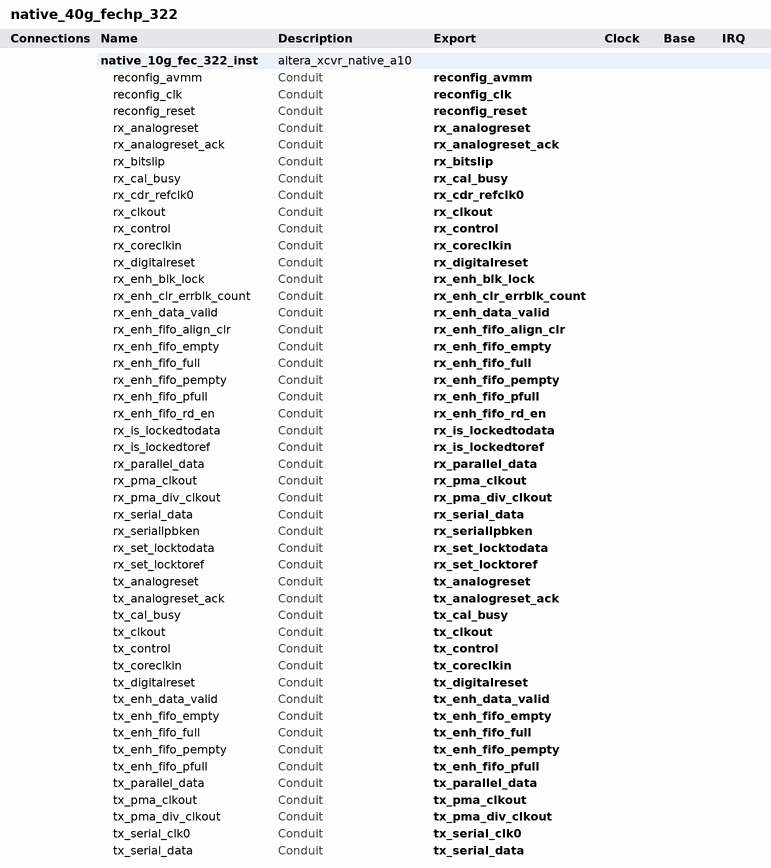
[diagram p0: system contents]
# Platform Designer (Qsys) system native_40g_fechp_322, Arria 10 10AX115U3F45I2SG
# Parameters at their usual value, and those the tool derives, are not listed.
package require -exact qsys 15.1
create_system native_40g_fechp_322
set_project_property DEVICE_FAMILY {Arria 10}
set_project_property DEVICE 10AX115U3F45I2SG

add_instance native_10g_fec_322_inst altera_xcvr_native_a10 15.1
set_instance_property native_10g_fec_322_inst AUTO_EXPORT true
set_instance_parameter_value native_10g_fec_322_inst anlg_rx_adp_ctle_acgain_4s radp_ctle_acgain_4s_0
set_instance_parameter_value native_10g_fec_322_inst anlg_rx_adp_ctle_eqz_1s_sel radp_ctle_eqz_1s_sel_0
set_instance_parameter_value native_10g_fec_322_inst anlg_rx_adp_vga_sel radp_vga_sel_0
set_instance_parameter_value native_10g_fec_322_inst anlg_rx_eq_dc_gain_trim no_dc_gain
set_instance_parameter_value native_10g_fec_322_inst anlg_rx_one_stage_enable non_s1_mode
set_instance_parameter_value native_10g_fec_322_inst anlg_voltage 1_1V
set_instance_parameter_value native_10g_fec_322_inst base_device NIGHTFURY5
set_instance_parameter_value native_10g_fec_322_inst bonded_mode not_bonded
set_instance_parameter_value native_10g_fec_322_inst channels 4
set_instance_parameter_value native_10g_fec_322_inst disconnect_analog_resets 0
set_instance_parameter_value native_10g_fec_322_inst enable_port_rx_analog_reset_ack 1
set_instance_parameter_value native_10g_fec_322_inst enable_port_rx_enh_bitslip 1
set_instance_parameter_value native_10g_fec_322_inst enable_port_rx_enh_blk_lock 1
set_instance_parameter_value native_10g_fec_322_inst enable_port_rx_enh_clr_errblk_count 1
set_instance_parameter_value native_10g_fec_322_inst enable_port_rx_enh_data_valid 1
set_instance_parameter_value native_10g_fec_322_inst enable_port_rx_enh_fifo_align_clr 1
set_instance_parameter_value native_10g_fec_322_inst enable_port_rx_enh_fifo_empty 1
set_instance_parameter_value native_10g_fec_322_inst enable_port_rx_enh_fifo_full 1
set_instance_parameter_value native_10g_fec_322_inst enable_port_rx_enh_fifo_pempty 1
set_instance_parameter_value native_10g_fec_322_inst enable_port_rx_enh_fifo_pfull 1
set_instance_parameter_value native_10g_fec_322_inst enable_port_rx_enh_fifo_rd_en 1
set_instance_parameter_value native_10g_fec_322_inst enable_port_rx_pma_clkout 1
set_instance_parameter_value native_10g_fec_322_inst enable_port_rx_pma_div_clkout 1
set_instance_parameter_value native_10g_fec_322_inst enable_port_rx_polinv 0
set_instance_parameter_value native_10g_fec_322_inst enable_port_rx_seriallpbken_tx 0
set_instance_parameter_value native_10g_fec_322_inst enable_port_rx_std_bitslip 0
set_instance_parameter_value native_10g_fec_322_inst enable_port_tx_analog_reset_ack 1
set_instance_parameter_value native_10g_fec_322_inst enable_port_tx_enh_fifo_empty 1
set_instance_parameter_value native_10g_fec_322_inst enable_port_tx_enh_fifo_full 1
set_instance_parameter_value native_10g_fec_322_inst enable_port_tx_enh_fifo_pempty 1
set_instance_parameter_value native_10g_fec_322_inst enable_port_tx_enh_fifo_pfull 1
set_instance_parameter_value native_10g_fec_322_inst enable_port_tx_pma_clkout 1
set_instance_parameter_value native_10g_fec_322_inst enable_port_tx_pma_div_clkout 1
set_instance_parameter_value native_10g_fec_322_inst enable_port_tx_polinv 0
set_instance_parameter_value native_10g_fec_322_inst enable_ports_rx_manual_cdr_mode 1
set_instance_parameter_value native_10g_fec_322_inst enable_simple_interface 0
set_instance_parameter_value native_10g_fec_322_inst enh_pcs_pma_width 64
set_instance_parameter_value native_10g_fec_322_inst enh_pld_pcs_width 66
set_instance_parameter_value native_10g_fec_322_inst enh_rx_blksync_enable 0
set_instance_parameter_value native_10g_fec_322_inst enh_rx_descram_enable 0
set_instance_parameter_value native_10g_fec_322_inst enh_rx_krfec_err_mark_enable 1
set_instance_parameter_value native_10g_fec_322_inst enh_rx_krfec_err_mark_type 40G
set_instance_parameter_value native_10g_fec_322_inst enh_rxfifo_mode Basic
set_instance_parameter_value native_10g_fec_322_inst enh_rxfifo_pempty 7
set_instance_parameter_value native_10g_fec_322_inst enh_tx_scram_enable 0
set_instance_parameter_value native_10g_fec_322_inst enh_tx_scram_seed 288230376151711743
set_instance_parameter_value native_10g_fec_322_inst enh_txfifo_mode Basic
set_instance_parameter_value native_10g_fec_322_inst enh_txfifo_pempty 5
set_instance_parameter_value native_10g_fec_322_inst enh_txfifo_pfull 13
set_instance_parameter_value native_10g_fec_322_inst generate_add_hdl_instance_example 1
set_instance_parameter_value native_10g_fec_322_inst generate_docs 1
set_instance_parameter_value native_10g_fec_322_inst message_level warning
set_instance_parameter_value native_10g_fec_322_inst protocol_mode fortyg_basekr_krfec_mode
set_instance_parameter_value native_10g_fec_322_inst rapid_validate 0
set_instance_parameter_value native_10g_fec_322_inst rcfg_file_prefix altera_xcvr_native_vi
set_instance_parameter_value native_10g_fec_322_inst rcfg_h_file_enable 1
set_instance_parameter_value native_10g_fec_322_inst rcfg_iface_enable 1
set_instance_parameter_value native_10g_fec_322_inst rcfg_jtag_enable 1
set_instance_parameter_value native_10g_fec_322_inst rcfg_mif_file_enable 1
set_instance_parameter_value native_10g_fec_322_inst rcfg_multi_enable 1
set_instance_parameter_value native_10g_fec_322_inst rcfg_profile_cnt 5
set_instance_parameter_value native_10g_fec_322_inst rcfg_profile_select 0
set_instance_parameter_value native_10g_fec_322_inst rcfg_reduced_files_enable 1
set_instance_parameter_value native_10g_fec_322_inst rcfg_separate_avmm_busy 0
set_instance_parameter_value native_10g_fec_322_inst rcfg_shared 1
set_instance_parameter_value native_10g_fec_322_inst rcfg_sv_file_enable 1
set_instance_parameter_value native_10g_fec_322_inst rx_pma_ctle_adaptation_mode one-time
set_instance_parameter_value native_10g_fec_322_inst rx_pma_dfe_adaptation_mode continuous
set_instance_parameter_value native_10g_fec_322_inst rx_pma_dfe_fixed_taps 7
set_instance_parameter_value native_10g_fec_322_inst rx_pma_div_clkout_divider 33
set_instance_parameter_value native_10g_fec_322_inst set_capability_reg_enable 1
set_instance_parameter_value native_10g_fec_322_inst set_cdr_refclk_freq 322.265625
set_instance_parameter_value native_10g_fec_322_inst set_csr_soft_logic_enable 1
set_instance_parameter_value native_10g_fec_322_inst set_data_rate 10312.5
set_instance_parameter_value native_10g_fec_322_inst set_embedded_debug_enable 1
set_instance_parameter_value native_10g_fec_322_inst set_odi_soft_logic_enable 1
set_instance_parameter_value native_10g_fec_322_inst set_prbs_soft_logic_enable 1
set_instance_parameter_value native_10g_fec_322_inst std_pcs_pma_width 10
set_instance_parameter_value native_10g_fec_322_inst std_rx_8b10b_enable 1
set_instance_parameter_value native_10g_fec_322_inst std_rx_byte_deser_mode Disabled
set_instance_parameter_value native_10g_fec_322_inst std_rx_polinv_enable 0
set_instance_parameter_value native_10g_fec_322_inst std_rx_word_aligner_mode {synchronous state machine}
set_instance_parameter_value native_10g_fec_322_inst std_rx_word_aligner_pattern_len 10
set_instance_parameter_value native_10g_fec_322_inst std_tx_8b10b_enable 1
set_instance_parameter_value native_10g_fec_322_inst std_tx_byte_ser_mode Disabled
set_instance_parameter_value native_10g_fec_322_inst std_tx_polinv_enable 0
set_instance_parameter_value native_10g_fec_322_inst tx_pma_div_clkout_divider 33

# exported interfaces
add_interface reconfig_avmm conduit end
set_interface_property reconfig_avmm EXPORT_OF native_10g_fec_322_inst.reconfig_avmm
add_interface reconfig_clk conduit end
set_interface_property reconfig_clk EXPORT_OF native_10g_fec_322_inst.reconfig_clk
add_interface reconfig_reset conduit end
set_interface_property reconfig_reset EXPORT_OF native_10g_fec_322_inst.reconfig_reset
add_interface rx_analogreset conduit end
set_interface_property rx_analogreset EXPORT_OF native_10g_fec_322_inst.rx_analogreset
add_interface rx_analogreset_ack conduit end
set_interface_property rx_analogreset_ack EXPORT_OF native_10g_fec_322_inst.rx_analogreset_ack
add_interface rx_bitslip conduit end
set_interface_property rx_bitslip EXPORT_OF native_10g_fec_322_inst.rx_bitslip
add_interface rx_cal_busy conduit end
set_interface_property rx_cal_busy EXPORT_OF native_10g_fec_322_inst.rx_cal_busy
add_interface rx_cdr_refclk0 conduit end
set_interface_property rx_cdr_refclk0 EXPORT_OF native_10g_fec_322_inst.rx_cdr_refclk0
add_interface rx_clkout conduit end
set_interface_property rx_clkout EXPORT_OF native_10g_fec_322_inst.rx_clkout
add_interface rx_control conduit end
set_interface_property rx_control EXPORT_OF native_10g_fec_322_inst.rx_control
add_interface rx_coreclkin conduit end
set_interface_property rx_coreclkin EXPORT_OF native_10g_fec_322_inst.rx_coreclkin
add_interface rx_digitalreset conduit end
set_interface_property rx_digitalreset EXPORT_OF native_10g_fec_322_inst.rx_digitalreset
add_interface rx_enh_blk_lock conduit end
set_interface_property rx_enh_blk_lock EXPORT_OF native_10g_fec_322_inst.rx_enh_blk_lock
add_interface rx_enh_clr_errblk_count conduit end
set_interface_property rx_enh_clr_errblk_count EXPORT_OF native_10g_fec_322_inst.rx_enh_clr_errblk_count
add_interface rx_enh_data_valid conduit end
set_interface_property rx_enh_data_valid EXPORT_OF native_10g_fec_322_inst.rx_enh_data_valid
add_interface rx_enh_fifo_align_clr conduit end
set_interface_property rx_enh_fifo_align_clr EXPORT_OF native_10g_fec_322_inst.rx_enh_fifo_align_clr
add_interface rx_enh_fifo_empty conduit end
set_interface_property rx_enh_fifo_empty EXPORT_OF native_10g_fec_322_inst.rx_enh_fifo_empty
add_interface rx_enh_fifo_full conduit end
set_interface_property rx_enh_fifo_full EXPORT_OF native_10g_fec_322_inst.rx_enh_fifo_full
add_interface rx_enh_fifo_pempty conduit end
set_interface_property rx_enh_fifo_pempty EXPORT_OF native_10g_fec_322_inst.rx_enh_fifo_pempty
add_interface rx_enh_fifo_pfull conduit end
set_interface_property rx_enh_fifo_pfull EXPORT_OF native_10g_fec_322_inst.rx_enh_fifo_pfull
add_interface rx_enh_fifo_rd_en conduit end
set_interface_property rx_enh_fifo_rd_en EXPORT_OF native_10g_fec_322_inst.rx_enh_fifo_rd_en
add_interface rx_is_lockedtodata conduit end
set_interface_property rx_is_lockedtodata EXPORT_OF native_10g_fec_322_inst.rx_is_lockedtodata
add_interface rx_is_lockedtoref conduit end
set_interface_property rx_is_lockedtoref EXPORT_OF native_10g_fec_322_inst.rx_is_lockedtoref
add_interface rx_parallel_data conduit end
set_interface_property rx_parallel_data EXPORT_OF native_10g_fec_322_inst.rx_parallel_data
add_interface rx_pma_clkout conduit end
set_interface_property rx_pma_clkout EXPORT_OF native_10g_fec_322_inst.rx_pma_clkout
add_interface rx_pma_div_clkout conduit end
set_interface_property rx_pma_div_clkout EXPORT_OF native_10g_fec_322_inst.rx_pma_div_clkout
add_interface rx_serial_data conduit end
set_interface_property rx_serial_data EXPORT_OF native_10g_fec_322_inst.rx_serial_data
add_interface rx_seriallpbken conduit end
set_interface_property rx_seriallpbken EXPORT_OF native_10g_fec_322_inst.rx_seriallpbken
add_interface rx_set_locktodata conduit end
set_interface_property rx_set_locktodata EXPORT_OF native_10g_fec_322_inst.rx_set_locktodata
add_interface rx_set_locktoref conduit end
set_interface_property rx_set_locktoref EXPORT_OF native_10g_fec_322_inst.rx_set_locktoref
add_interface tx_analogreset conduit end
set_interface_property tx_analogreset EXPORT_OF native_10g_fec_322_inst.tx_analogreset
add_interface tx_analogreset_ack conduit end
set_interface_property tx_analogreset_ack EXPORT_OF native_10g_fec_322_inst.tx_analogreset_ack
add_interface tx_cal_busy conduit end
set_interface_property tx_cal_busy EXPORT_OF native_10g_fec_322_inst.tx_cal_busy
add_interface tx_clkout conduit end
set_interface_property tx_clkout EXPORT_OF native_10g_fec_322_inst.tx_clkout
add_interface tx_control conduit end
set_interface_property tx_control EXPORT_OF native_10g_fec_322_inst.tx_control
add_interface tx_coreclkin conduit end
set_interface_property tx_coreclkin EXPORT_OF native_10g_fec_322_inst.tx_coreclkin
add_interface tx_digitalreset conduit end
set_interface_property tx_digitalreset EXPORT_OF native_10g_fec_322_inst.tx_digitalreset
add_interface tx_enh_data_valid conduit end
set_interface_property tx_enh_data_valid EXPORT_OF native_10g_fec_322_inst.tx_enh_data_valid
add_interface tx_enh_fifo_empty conduit end
set_interface_property tx_enh_fifo_empty EXPORT_OF native_10g_fec_322_inst.tx_enh_fifo_empty
add_interface tx_enh_fifo_full conduit end
set_interface_property tx_enh_fifo_full EXPORT_OF native_10g_fec_322_inst.tx_enh_fifo_full
add_interface tx_enh_fifo_pempty conduit end
set_interface_property tx_enh_fifo_pempty EXPORT_OF native_10g_fec_322_inst.tx_enh_fifo_pempty
add_interface tx_enh_fifo_pfull conduit end
set_interface_property tx_enh_fifo_pfull EXPORT_OF native_10g_fec_322_inst.tx_enh_fifo_pfull
add_interface tx_parallel_data conduit end
set_interface_property tx_parallel_data EXPORT_OF native_10g_fec_322_inst.tx_parallel_data
add_interface tx_pma_clkout conduit end
set_interface_property tx_pma_clkout EXPORT_OF native_10g_fec_322_inst.tx_pma_clkout
add_interface tx_pma_div_clkout conduit end
set_interface_property tx_pma_div_clkout EXPORT_OF native_10g_fec_322_inst.tx_pma_div_clkout
add_interface tx_serial_clk0 conduit end
set_interface_property tx_serial_clk0 EXPORT_OF native_10g_fec_322_inst.tx_serial_clk0
add_interface tx_serial_data conduit end
set_interface_property tx_serial_data EXPORT_OF native_10g_fec_322_inst.tx_serial_data

set_interconnect_requirement {$system} qsys_mm.clockCrossingAdapter HANDSHAKE
set_interconnect_requirement {$system} qsys_mm.insertDefaultSlave FALSE
set_interconnect_requirement {$system} qsys_mm.maxAdditionalLatency 1

save_system native_40g_fechp_322.qsys
